# EAGLE design MACH DEM sp dung ic74192 (EAGLE 5.07)
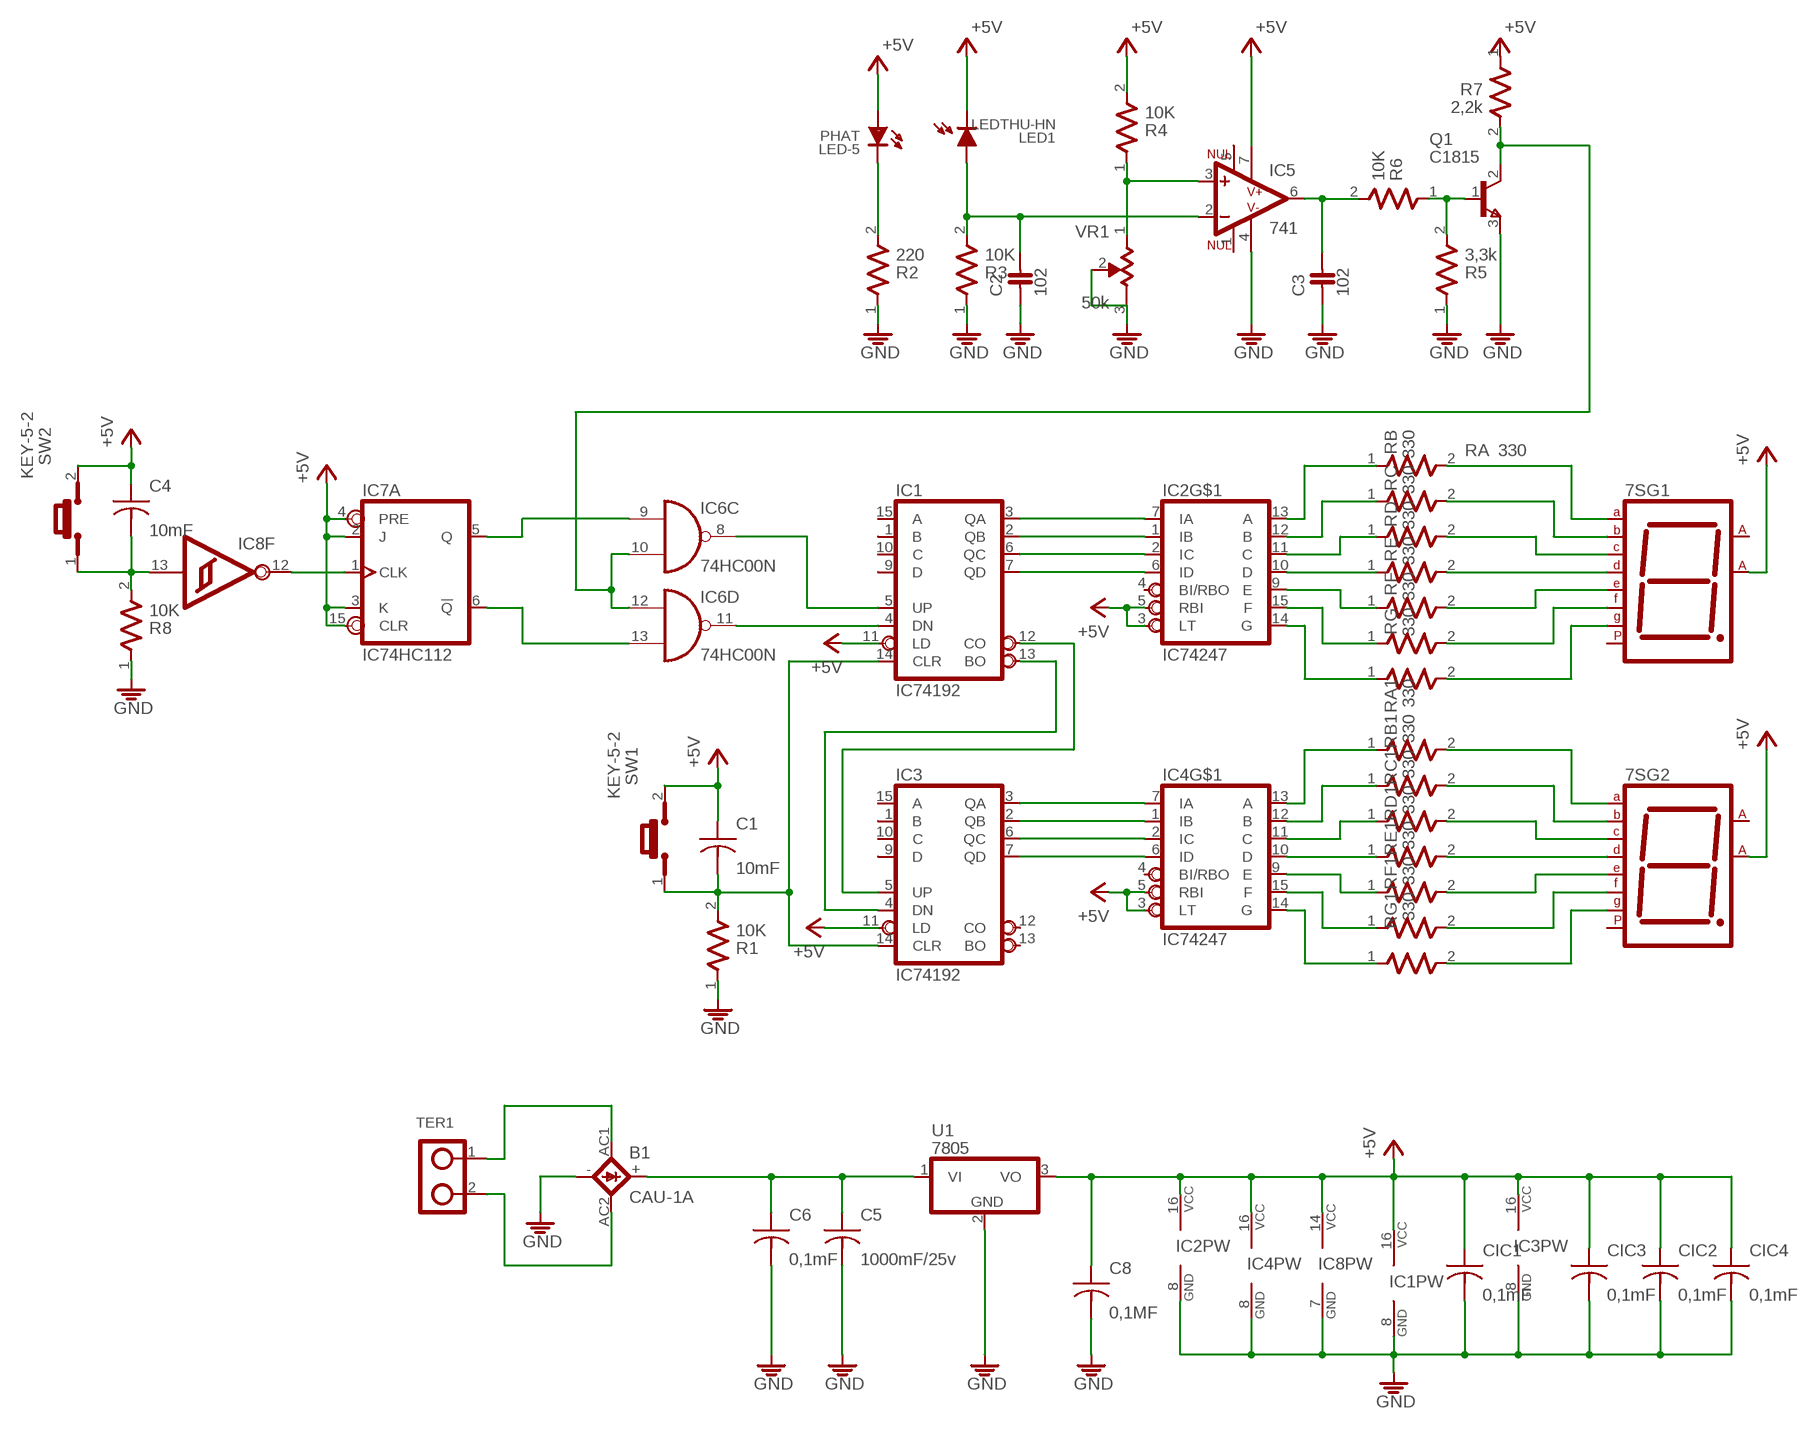
[diagram p0: schematic, sheet 1]

## Parts
7SG1  7SG-A1  [7SG-A]
7SG2  7SG-A1  [7SG-A]
B1  CAU-1A  [CAU-1A]
C1  10mF  CAP-2,5  [CAP-2,5]
C2  102  CAPNP-2,5  [CANP-2,5]
C3  102  CAPNP-2,5  [CANP-2,5]
C4  10mF  CAP-2,5  [CAP-2,5]
C5  1000mF/25v  CAP-5  [CAP-5]
C6  0,1mF  CAP-2,5  [CAP-2,5]
C8  0,1MF  CAP-2,5  [CAP-2,5]
CIC1  0,1mF  CAP-2,5  [CAP-2,5]
CIC2  0,1mF  CAP-2,5  [CAP-2,5]
CIC3  0,1mF  CAP-2,5  [CAP-2,5]
CIC4  0,1mF  CAP-2,5  [CAP-2,5]
IC1  IC74192  [DIL-16]
IC2  IC74247  [DIL-16]
IC3  IC74192  [DIL-16]
IC4  IC74247  [DIL-16]
IC5  741  TL081  [DIL-8]
IC6  74HC00N  [DIL14]
IC7  IC74HC112  [DIL-16]
IC8  74HC14  [DIL-14]
LED1  LEDTHU-HN  [LED5]
PHAT  LED-5  [LED5]
Q1  C1815  [TO92L]
R1  10K  R-7,5  [R-7,5]
R2  220  R-7,5  [R-7,5]
R3  10K  R-7,5  [R-7,5]
R4  10K  R-7,5  [R-7,5]
R5  3,3k  R-7,5  [R-7,5]
R6  10K  R-7,5  [R-7,5]
R7  2,2k  R-7,5  [R-7,5]
R8  10K  R-7,5  [R-7,5]
RA  330  R-10  [R-10]
RA1  330  R-10  [R-10]
RB  330  R-10  [R-10]
RB1  330  R-10  [R-10]
RC  330  R-10  [R-10]
RC1  330  R-10  [R-10]
RD  330  R-10  [R-10]
RD1  330  R-10  [R-10]
RE  330  R-10  [R-10]
RE1  330  R-10  [R-10]
RF  330  R-10  [R-10]
RF1  330  R-10  [R-10]
RG  330  R-10  [R-10]
RG1  330  R-10  [R-10]
SW1  KEY-5-2  [KEY-5-2]
SW2  KEY-5-2  [KEY-5-2]
TER1  DOMINO-2  [DOMI-2]
U1  7805  78XX-S  [78XX-S]
VR1  50k  VR-5  [VR-5]

## Nets
+5V: 7SG1.8(CA2) 7SG2.8(CA2) C1.+ C4.+ C8.+ CIC1.+ CIC2.+ CIC3.+ CIC4.+ IC1.11(LD) IC1.16(VCC) IC2.3(LT) IC2.5(RBI) IC2.16(PW:VCC) IC3.11(LD) IC3.16(VCC) IC4.3(LT) IC4.5(RBI) IC4.16(PW:VCC) IC5.7(V+) IC7.2(A:J) IC7.3(A:K) IC7.4(A:PRE) IC7.15(A:CLR) IC8.14(PW:VCC) LED1.K PHAT.A R4.2 R7.1 SW1.2 SW2.2 U1.3(VO)
GND: B1.- C2.1 C3.1 C5.- C6.- C8.- CIC1.- CIC2.- CIC3.- CIC4.- IC1.8(GND) IC2.8(PW:GND) IC3.8(GND) IC4.8(PW:GND) IC5.4(V-) IC8.7(PW:GND) Q1.3(E) R1.1 R2.1 R3.1 R5.1 R8.1 U1.2(GND) VR1.2 VR1.3
N$1: IC1.2(QB) IC2.1(IB)
N$2: IC1.6(QC) IC2.2(IC)
N$3: IC1.7(QD) IC2.6(ID)
N$4: IC1.3(QA) IC2.7(IA)
N$5: IC2.13(A) RA.1
N$6: IC2.12(B) RB.1
N$7: IC2.11(C) RC.1
N$8: IC2.10(D) RD.1
N$9: IC2.9(E) RE.1
N$10: IC2.15(F) RF.1
N$11: IC2.14(G) RG.1
N$12: 7SG1.7(A) RA.2
N$13: 7SG1.6(B) RB.2
N$14: 7SG1.4(C) RC.2
N$15: 7SG1.2(D) RD.2
N$16: 7SG1.1(E) RE.2
N$17: 7SG1.9(F) RF.2
N$18: 7SG1.10(G) RG.2
N$19: IC5.3(+IN) R4.1 VR1.1
N$20: IC3.6(QC) IC4.2(IC)
N$21: IC3.7(QD) IC4.6(ID)
N$22: IC3.3(QA) IC4.7(IA)
N$23: IC4.13(A) RA1.1
N$24: IC4.12(B) RB1.1
N$25: IC4.11(C) RC1.1
N$26: IC4.10(D) RD1.1
N$27: IC4.9(E) RE1.1
N$28: IC4.15(F) RF1.1
N$29: IC4.14(G) RG1.1
N$30: 7SG2.7(A) RA1.2
N$31: 7SG2.6(B) RB1.2
N$32: 7SG2.4(C) RC1.2
N$33: 7SG2.2(D) RD1.2
N$34: 7SG2.1(E) RE1.2
N$35: 7SG2.9(F) RF1.2
N$36: 7SG2.10(G) RG1.2
N$37: IC1.12(CO) IC3.5(UP)
N$38: C2.2 IC5.2(-IN) LED1.A R3.2
N$39: PHAT.K R2.2
N$41: C1.- IC1.14(CLR) IC3.14(CLR) R1.2 SW1.1
N$42: Q1.1(B) R5.2 R6.1
N$43: C3.2 IC5.6(OUT) R6.2
N$44: IC6.10(C:I1) IC6.12(D:I0) Q1.2(C) R7.2
N$45: IC1.4(DN) IC6.11(D:O)
N$46: IC1.5(UP) IC6.8(C:O)
N$47: IC1.13(BO) IC3.4(DN)
N$48: IC6.9(C:I0) IC7.5(A:Q)
N$49: IC6.13(D:I1) IC7.6(A:!Q)
N$50: IC3.2(QB) IC4.1(IB)
N$51: B1.+ C5.+ C6.+ U1.1(VI)
N$52: C4.- IC8.13(F:I) R8.2 SW2.1
N$53: IC7.1(A:CLK) IC8.12(F:O)
N$54: B1.AC1 TER1.1
N$55: B1.AC2 TER1.2
Unconnected: 7SG1.3(CA1) 7SG1.5(DP) 7SG2.3(CA1) 7SG2.5(DP) IC1.1(B) IC1.9(D) IC1.10(C) IC1.15(A) IC2.4(BI/RBO) IC3.1(B) IC3.9(D) IC3.10(C) IC3.12(CO) IC3.13(BO) IC3.15(A) IC4.4(BI/RBO) IC6.1(A:I0) IC6.2(A:I1) IC6.3(A:O) IC6.4(B:I0) IC6.5(B:I1) IC6.6(B:O) IC7.7(B:!Q) IC7.9(B:Q) IC7.10(B:PRE) IC7.11(B:J) IC7.12(B:K) IC7.13(B:CLK) IC7.14(B:CLR) IC8.1(A:I) IC8.2(A:O) IC8.3(B:I) IC8.4(B:O) IC8.5(C:I) IC8.6(C:O) IC8.8(D:O) IC8.9(D:I) IC8.10(E:O) IC8.11(E:I)

## Power pins joined to a net without a drawn wire
GND: IC6.7(P:GND) IC7.8(PW:GND)
NUL-1: IC5.5(NUL-1)
NUL-2: IC5.1(NUL-2)
VCC: IC6.14(P:VCC) IC7.16(PW:VCC)

## Library data of the parts
7SG1 7SG2 = chuong:7SG-A1
B1 = chuong:CAU-1A
C1 C4 C6 C8 CIC1-CIC4 = chuong:CAP-2,5
C2 C3 = chuong:CAPNP-2,5
C5 = chuong:CAP-5
IC1 IC3 = chuong:IC74192
IC2 IC4 = chuong:IC74247
IC5 = chuong:TL081
IC6 = 74xx-eu:74*00: Quad 2-input NAND gate
IC7 = chuong:IC74HC112
IC8 = chuong:74HC14
LED1 = chuong:LEDTHU-HN
PHAT = chuong:LED-5
Q1 = chuong:C1815
R1-R8 = chuong:R-7,5
RA RA1 RB RB1 RC RC1 RD RD1 RE RE1 RF RF1 RG RG1 = chuong:R-10
SW1 SW2 = chuong:KEY-5-2
TER1 = chuong:DOMINO-2
U1 = chuong:78XX-S
VR1 = chuong:VR-5

## Net classes
0 default: width 0.7 mm, clearance 0.7 mm

## Board
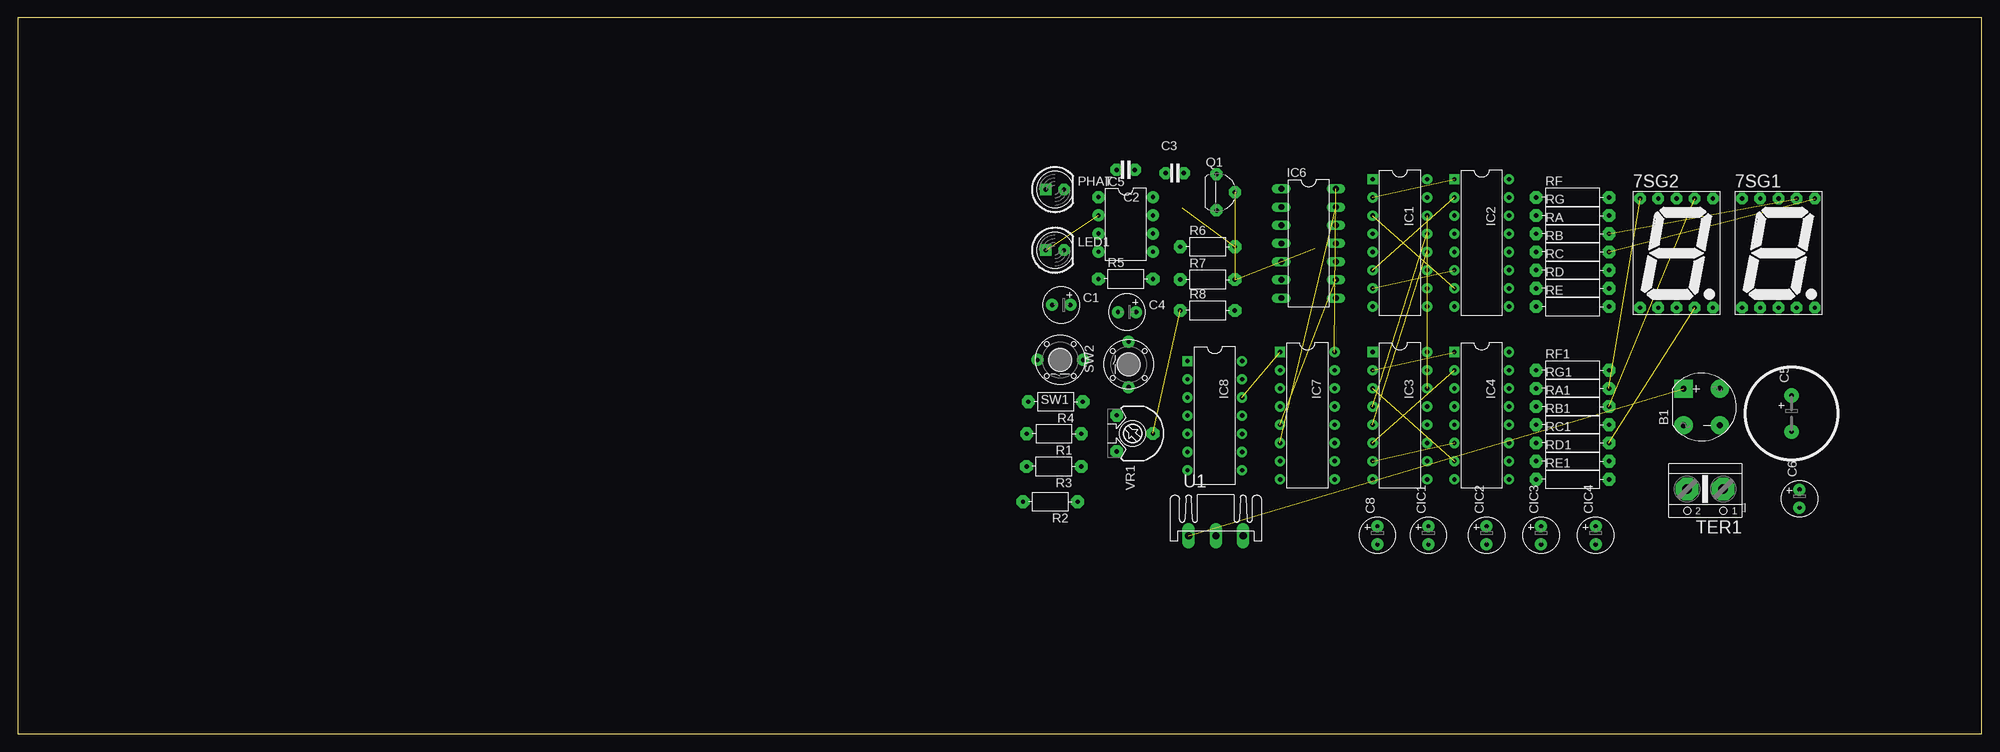
[diagram p1: board, top side]
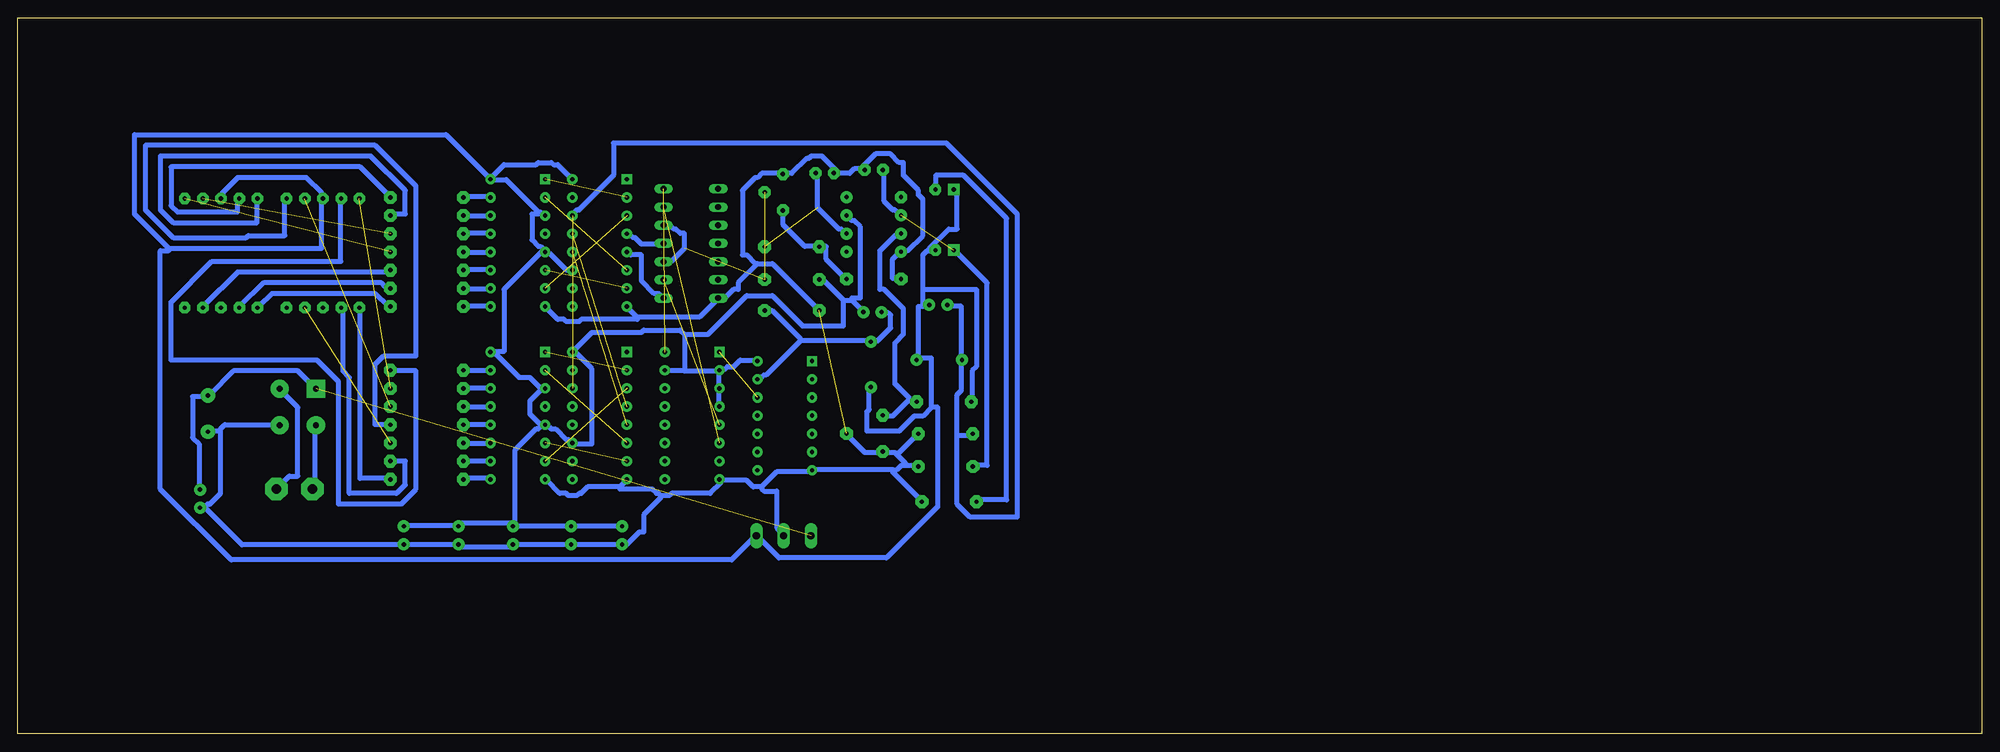
[diagram p2: board, bottom side, seen from below]

Size 274.3 x 100 mm. Coordinates in mm from the lower left corner, seen from the top.
Outline: 0,0 274.3,0 274.3,100 0,100 0,0
Copper layers (1*16): Top 0.035mm / dielectric 1.5mm / Bottom 0.035mm
Design rules "default": minimum track width 10mil, minimum drill 24mil, track to track 8mil, track to pad 8mil, pad to pad 8mil, via to via 8mil, smd to smd 8mil, copper to edge 40mil, drill to drill 8mil, minimum pad ring 10mil, minimum via ring 8mil, stop-mask expansion 4mil, vias tented up to drill 0mil, thermal gap 10mil

### Footprints (pad centres in the part's own frame; a part is rotated, then mirrored left to right if it is on the bottom)
7SG-A = drill 0.61 pad 1.6 octagon: 1 -5.08,-7.62; 2 -2.54,-7.62; 3 0,-7.62; 4 2.54,-7.62; 5 5.08,-7.62; 6 5.08,7.62; 7 2.54,7.62; 8 0,7.62; 9 -2.54,7.62; 10 -5.08,7.62
CAU-1A = drill 0.813 pad 2.54 square: + -2.54,2.54 | drill 0.813 pad 2.54 round: - 2.54,-2.54; AC1 2.54,2.54; AC2 -2.54,-2.54
CAP-2,5 = drill 0.61 pad 1.676 round: + 1.27,0; - -1.27,0
CANP-2,5 = drill 0.61 pad 1.676 octagon: 1 -1.27,0; 2 1.27,0
CAP-5 = drill 0.61 pad 2 round: + 2.54,0; - -2.54,0
DIL-16 = drill 0.61 pad 1.422 square: 1 -8.89,-3.81 | drill 0.61 pad 1.422 round: 2 -6.35,-3.81; 3 -3.81,-3.81; 4 -1.27,-3.81; 5 1.27,-3.81; 6 3.81,-3.81; 7 6.35,-3.81; 8 8.89,-3.81; 9 8.89,3.81; 10 6.35,3.81; 11 3.81,3.81; 12 1.27,3.81; 13 -1.27,3.81; 14 -3.81,3.81; 15 -6.35,3.81; 16 -8.89,3.81
DIL-8 = drill 0.61 pad 1.676 octagon: 1 -3.81,-3.81 | drill 0.61 pad 1.676 round: 2 -1.27,-3.81; 3 1.27,-3.81; 4 3.81,-3.81; 5 3.81,3.81; 6 1.27,3.81; 7 -1.27,3.81; 8 -3.81,3.81
DIL14 = drill 0.813 long: 1 -7.62,-3.81; 2 -5.08,-3.81; 3 -2.54,-3.81; 4 0,-3.81; 5 2.54,-3.81; 6 5.08,-3.81; 7 7.62,-3.81; 8 7.62,3.81; 9 5.08,3.81; 10 2.54,3.81; 11 0,3.81; 12 -2.54,3.81; 13 -5.08,3.81; 14 -7.62,3.81
DIL-14 = drill 0.61 pad 1.422 square: 1 -7.62,-3.81 | drill 0.61 pad 1.422 round: 2 -5.08,-3.81; 3 -2.54,-3.81; 4 0,-3.81; 5 2.54,-3.81; 6 5.08,-3.81; 7 7.62,-3.81; 8 7.62,3.81; 9 5.08,3.81; 10 2.54,3.81; 11 0,3.81; 12 -2.54,3.81; 13 -5.08,3.81; 14 -7.62,3.81
LED5 = drill 0.61 pad 1.6 square: A -1.27,0 | drill 0.61 pad 1.6 octagon: K 1.27,0
TO92L = drill 0.61 pad 1.676 octagon: 1 2.54,0; 2 0,2.54; 3 -2.54,0
R-7,5 = drill 0.61 pad 1.778 octagon: 1 -3.81,0; 2 3.81,0
R-10 = drill 0.61 pad 1.778 octagon: 1 -5.08,0; 2 5.08,0
KEY-5-2 = drill 0.61 pad 1.676 round: 1 -3.81,0; 2 2.54,0
DOMI-2 = drill 1.321 pad 3.15 octagon: 1 -2.515,0; 2 2.515,0
78XX-S = drill 1.016 pad 1.778 long: 1 -2.54,-1.27; 2 1.27,-1.27; 3 5.08,-1.27
VR-5 = drill 0.61 pad 1.778 octagon: 1 -2.54,-2.54; 2 0,2.54; 3 2.54,-2.54

### Placement (x,y rotation side)
7SG1  245.92,67.15 0 top
7SG2  231.68,67.15 0 top
B1  235.2,45.67 0 top
C1  145.73,59.92 0 top
C2  154.75,78.78 180 top
C3  161.6,78.34 0 top
C4  154.93,58.92 0 top
C5  247.75,44.74 90 top
C6  248.86,32.86 90 top
C8  189.91,27.74 90 top
CIC1  197.03,27.74 90 top
CIC2  205.15,27.74 90 top
CIC3  212.77,27.74 90 top
CIC4  220.39,27.74 90 top
IC1  193.04,68.58 270 top
IC2  204.47,68.58 270 top
IC3  193.04,44.45 270 top
IC4  204.47,44.45 270 top
IC5  154.75,71.16 270 top
IC6  180.3,68.5 270 top
IC7  180.11,44.45 270 top
IC8  167.18,44.45 270 top
LED1  144.86,67.56 0 top
PHAT  144.86,76.03 0 top
Q1  167.45,75.66 270 top
R1  144.72,41.93 180 top
R2  144.21,32.44 180 top
R3  144.71,37.36 180 top
R4  144.95,46.4 180 top
R5  154.75,63.54 0 top
R6  166.18,68.04 0 top
R7  166.18,63.46 0 top
R8  166.18,59.15 0 top
RA  217.17,69.85 0 top
RA1  217.17,45.72 0 top
RB  217.17,67.31 0 top
RB1  217.17,43.18 0 top
RC  217.17,64.77 0 top
RC1  217.17,40.64 0 top
RD  217.17,62.23 0 top
RD1  217.17,38.1 0 top
RE  217.17,59.69 0 top
RE1  217.17,35.56 0 top
RF  217.17,74.93 0 top
RF1  217.17,50.8 0 top
RG  217.17,72.39 0 top
RG1  217.17,48.26 0 top
SW1  146.23,52.24 0 top
SW2  155.16,50.97 270 top
TER1  235.7,34.2 180 top
U1  166.07,28.94 0 top
VR1  156.02,41.97 270 top

### Tracks (layer width: path | path; a pad name or v marks a point on that pad's centre or on a via)
+5V
  Bottom 0.7: 147,67.5 147.3,67.5 147.9,66.9 147.9,62.1 | 147,67.5 146.4,67.5 LED1.K | 147.9,60 147.9,62.1 | 147.9,60 147,60 C1.+ | PHAT.A 143.4,75.9 143.1,75.6 143.1,70.5 144.3,70.5 147,67.8 147,67.5 | IC1.16 197.1,77.7 198.9,79.5 199.5,79.5 199.8,79.8 201.6,79.8 201.9,79.5 206.4,79.5 208.2,77.7 IC2.16 | 201.6,72.9 201.3,72.9 201,72.6 200.7,72.6 IC2.3 | 201.6,72.9 206.1,77.4 208.2,77.4 IC2.16 | IC1.11 197.1,64.8 197.7,64.8 200.1,67.2 200.4,67.2 IC2.5 | 7SG1.8 245.7,75 245.7,75.6 243.6,77.7 234,77.7 231.9,75.6 231.9,75 7SG2.8 231.9,74.7 231.9,67.8 253.2,67.8 | 157.8,60.6 156.3,59.1 C4.+ | 159,60.6 157.8,60.6 | 159,60.6 162,63.6 162.3,63.6 R7.1 | IC7.4 176.4,45.9 176.4,48 IC7.3 176.4,48.3 176.4,50.4 IC7.2 | IC7.2 176.1,51 175.5,51 175.2,51.3 174.3,51.3 173.4,52.2 171,52.2 IC8.14 | 181.2,50.7 176.4,50.7 IC7.2 | 181.2,50.7 183.9,50.7 IC7.15 | 181.2,55.8 181.8,56.4 186.9,56.4 187.2,56.1 194.1,56.1 196.8,53.4 IC3.16 196.8,53.1 196.2,53.1 194.1,51 194.1,40.5 196.8,40.5 IC3.11 197.1,40.8 197.4,41.1 197.7,41.1 199.2,42.6 199.8,42.6 200.1,42.9 200.4,42.9 IC4.5 | 181.2,55.8 181.2,50.7 | IC4.5 201,43.2 201.3,43.2 202.8,44.7 202.8,46.5 201.3,48 200.7,48 IC4.3 201.3,48.3 202.8,49.8 204.3,49.8 207.6,53.1 208.2,53.1 IC4.16 207.6,53.4 206.4,53.4 206.4,62.1 201,67.5 IC2.5 | CIC4.+ 220.2,29.1 213,29.1 CIC3.+ 213,29.4 204.9,29.4 CIC2.+ | C8.+ 190.2,29.1 196.8,29.1 CIC1.+ 197.1,29.1 204.9,29.1 CIC2.+ | IC4.5 201.3,42.9 201.6,42.6 201.9,42.6 204.9,39.6 204.9,29.7 CIC2.+ | 147.9,60 147.9,59.7 148.5,59.7 148.5,52.5 SW1.2 148.2,52.5 146.7,52.5 146.7,45.6 | 146.7,45.6 147.9,44.4 149.1,44.4 151.2,42.3 155.7,42.3 155.7,45 155.4,45.3 155.4,48.3 SW2.2
  Bottom 0.7: 146.7,45.6 145.8,45.6 145.8,31.8 153,24.6 168,24.6 171,27.6 U1.3 171.3,27.6 174.6,24.3 244.5,24.3 254.4,34.2 254.4,67.5 253.2,67.5 253.2,67.8 | R4.2 141,46.5 141,50.7 140.4,51.3 140.4,62.1 147.9,62.1 | IC5.7 158.4,72.3 157.8,71.7 157.5,71.7 156.6,70.8 156.6,60.9 157.8,60.9 157.8,60.6 | IC2.5 200.7,67.5 201.3,68.1 201.6,68.1 202.5,69 202.5,72.6 201.6,72.6 201.6,72.9 | 159,60.6 159,57 164.7,57 168.9,61.2 172.5,61.2 177.9,55.8 181.2,55.8 | 253.2,67.8 258,72.6 258,83.7 214.5,83.7 208.5,77.7 IC2.16
GND  (1 unrouted)
  Bottom 0.7: 190.2,34.5 189.3,35.4 IC3.8 | 190.2,34.5 194.7,34.5 195.6,33.6 195.9,33.6 196.2,33.3 197.4,33.3 197.7,33.6 198.6,33.6 200.4,35.4 IC4.8 | 152.1,36.9 151.5,36.9 150.9,37.5 150.3,37.5 | 152.1,36.9 163.2,36.9 IC8.7 163.5,36.6 168.3,36.6 170.4,34.5 | 150.3,37.5 148.8,37.5 R3.1 | 170.4,34.5 171.6,34.5 172.5,35.4 176.1,35.4 IC7.8 176.1,35.1 177.6,33.6 183,33.6 183.3,33.3 184.5,33.3 | U1.2 167.4,27.9 168.3,28.8 168.3,33.9 170.1,33.9 170.4,34.2 170.4,34.5 | R2.1 148.2,32.7 152.1,36.6 152.1,36.9 | 151.8,39.3 153.3,39.3 VR1.3 153.6,39.3 156,39.3 158.4,41.7 VR1.2 | 151.8,39.3 150.3,37.8 150.3,37.5 | R1.1 148.8,41.7 151.2,39.3 151.8,39.3 | 184.5,33.3 184.8,33.6 185.1,33.6 185.7,34.2 190.2,34.2 190.2,34.5 | 246,42.3 246,33.6 247.5,32.1 247.8,32.1 248.1,31.8 248.7,31.8 C6.- 248.1,31.5 243,26.4 220.5,26.4 CIC4.- 220.2,26.4 213,26.4 CIC3.- 213,26.1 204.9,26.1 CIC2.- 204.9,26.4 197.1,26.4 CIC1.- 196.8,26.4 190.2,26.4 C8.- 189.6,26.4 189.3,26.4 187.5,28.2 186.9,28.2 186.9,30.6 184.5,33 184.5,33.3 | 246,42.3 247.5,42.3 C5.- | B1.- 237.9,43.2 245.4,43.2 246,42.6 246,42.3 | R5.1 151.2,63.6 152.1,63.6 152.1,66.3 151.2,67.2 IC5.4 150.9,67.5 150,67.5 147.9,69.6 147.9,74.7 148.5,75.3 148.5,75.9 150.6,78 150.6,79.8 151.2,79.8 152.4,81 154.5,81 156.3,79.2 C2.1 156.3,78.9 157.5,78.9 158.1,78.3 160.2,78.3 C3.1 159.9,78.6 162,80.7 163.5,80.7 163.8,80.4 164.1,80.4 166.2,78.3 167.4,78.3 Q1.3 167.7,78.3 170.4,78.3 171,77.7 171.3,77.7 173.1,75.9 173.1,66.9 172.5,66.9 171.3,65.7 171,65.7 | 187.8,58.2 179.1,58.2 176.7,60.6 IC6.7 176.4,60.9 175.5,60.9 174.3,62.1 173.7,62.1 173.7,63 171,65.7
  Bottom 0.7: 187.8,58.2 189,59.4 IC1.8 | IC2.8 200.4,59.4 198.9,57.9 198,57.9 197.7,57.6 195.9,57.6 195.6,57.9 187.8,57.9 187.8,58.2 | 171,65.7 168.9,65.7 162.6,59.4 R8.1
N$1  (1 unrouted)
N$2  (1 unrouted)
N$3  (1 unrouted)
N$4  (1 unrouted)
N$5
  Bottom 0.7: IC2.13 208.5,69.9 211.8,69.9 RA.1
N$6
  Bottom 0.7: IC2.12 208.5,67.2 211.8,67.2 RB.1
N$7
  Bottom 0.7: IC2.11 208.5,64.8 211.8,64.8 RC.1
N$8
  Bottom 0.7: IC2.10 208.5,62.1 211.8,62.1 RD.1
N$9
  Bottom 0.7: IC2.9 208.5,59.7 211.8,59.7 RE.1
N$10
  Bottom 0.7: IC2.15 208.5,75 211.8,75 RF.1
N$11
  Bottom 0.7: IC2.14 208.5,72.3 211.8,72.3 RG.1
N$12  (1 unrouted)
N$13  (1 unrouted)
N$14
  Bottom 0.7: 7SG1.4 248.4,59.7 243.6,64.5 222.3,64.5 RC.2
N$15
  Bottom 0.7: 7SG1.2 243.3,59.7 240,63 223.5,63 222.9,62.4 222.3,62.4 RD.2
N$16
  Bottom 0.7: 7SG1.1 240.6,59.7 238.8,61.5 224.4,61.5 222.6,59.7 222.3,59.7 RE.2
N$17
  Bottom 0.7: 7SG1.9 243.6,74.7 243.6,72.9 252,72.9 252.9,73.8 252.9,79.2 226.5,79.2 222.3,75 RF.2
N$18
  Bottom 0.7: 7SG1.10 240.9,74.7 240.9,71.4 252.6,71.4 254.4,73.2 254.4,80.7 225,80.7 220.2,75.9 220.2,72.6 222,72.6 RG.2
N$19
  Bottom 0.7: 149.7,46.5 150,46.5 152.1,44.4 153.3,44.4 VR1.1 | 149.7,46.5 148.8,46.5 R4.1 | IC5.3 151.2,69.6 151.8,69.6 153.9,67.5 153.9,62.1 153.3,62.1 150.6,59.4 150.6,55.8 151.8,54.6 151.8,48.9 149.7,46.8 149.7,46.5
N$20  (1 unrouted)
N$21  (1 unrouted)
N$22  (1 unrouted)
N$23
  Bottom 0.7: IC4.13 208.5,45.6 211.8,45.6 RA1.1
N$24
  Bottom 0.7: IC4.12 208.5,43.2 211.8,43.2 RB1.1
N$25
  Bottom 0.7: IC4.11 208.5,40.5 211.8,40.5 RC1.1
N$26
  Bottom 0.7: IC4.10 RD1.1
N$27
  Bottom 0.7: IC4.9 208.5,35.7 211.8,35.7 RE1.1
N$28
  Bottom 0.7: IC4.15 208.5,50.7 211.8,50.7 RF1.1
N$29
  Bottom 0.7: IC4.14 208.5,48.3 211.8,48.3 RG1.1
N$30  (1 unrouted)
N$31
  Bottom 0.7: 7SG2.6 237,74.7 237,69.6 242.1,69.6 242.4,69.3 252.6,69.3 256.5,73.2 256.5,82.2 224.4,82.2 218.7,76.5 218.7,52.8 223.2,52.8 224.4,51.6 224.4,43.2 222.3,43.2 RB1.2
N$32  (1 unrouted)
N$33
  Bottom 0.7: 7SG2.2 228.9,59.4 228.9,50.7 228,49.8 228,33.6 221.4,33.6 220.2,34.8 220.2,38.1 RD1.2
N$34
  Bottom 0.7: 7SG2.1 226.5,59.4 226.5,35.7 222.3,35.7 RE1.2
N$35
  Bottom 0.7: 7SG2.9 229.2,74.7 229.2,66 247.2,66 252.9,60.3 252.9,52.2 232.5,52.2 229.5,49.2 229.5,32.1 220.8,32.1 218.7,34.2 218.7,50.7 222,50.7 RF1.2
N$36  (1 unrouted)
N$37  (1 unrouted)
N$38  (1 unrouted)
  Bottom 0.7: LED1.A 143.4,67.5 138.9,63 138.9,37.5 140.7,37.5 R3.2 | IC5.2 151.2,72.6 151.8,73.2 152.1,73.2 153.3,74.4 153.3,78.6 C2.2
N$39
  Bottom 0.7: PHAT.K 146.1,76.2 146.1,78 142.2,78 136.2,72 136.2,32.7 140.4,32.7 R2.2
N$41  (1 unrouted)
  Bottom 0.7: C1.- 144.3,59.7 142.5,59.7 142.5,52.5 SW1.1 142.5,51.9 142.5,48 143.1,47.4 143.1,41.7 | 143.1,41.7 143.1,32.1 141.3,30.3 134.7,30.3 134.7,72.6 144.6,82.5 191.1,82.5 191.1,78 195.9,73.2 196.2,73.2 196.8,72.6 IC1.14 | 143.1,41.7 141,41.7 R1.2
N$42
  Bottom 0.7: R5.2 158.7,63.6 161.4,66.3 161.4,68.1 162.3,68.1 R6.1 162.6,68.1 164.4,68.1 167.4,71.1 167.4,72.9 Q1.1
N$43  (1 unrouted)
  Bottom 0.7: IC5.6 158.7,69.9 159.3,70.5 159.6,70.5 162.6,73.5 162.6,78.3 C3.2
N$44  (2 unrouted)
  Bottom 0.7: IC6.10 183.9,66 183,66 181.2,67.8 181.2,69.9 181.8,69.9 182.4,70.5 182.7,70.5 183,70.8 183.9,70.8 IC6.12
N$45
  Bottom 0.7: IC6.11 184.2,68.4 187.2,68.4 188.1,69.3 188.4,69.3 188.7,69.6 189,69.6 IC1.4
N$46
  Bottom 0.7: IC6.8 184.2,60.9 184.8,61.5 185.4,61.5 187.2,63.3 187.2,66.9 188.7,66.9 189,67.2 IC1.5
N$47  (1 unrouted)
N$48  (1 unrouted)
N$49  (1 unrouted)
N$50  (1 unrouted)
N$51  (1 unrouted)
  Bottom 0.7: C6.+ 249,34.2 249,40.5 249.9,41.4 249.9,47.1 247.8,47.1 C5.+ 247.5,47.4 244.2,50.7 235.2,50.7 232.8,48.3 B1.+
N$52
  Bottom 0.7: C4.- 153.6,58.8 152.7,58.8 152.4,58.5 152.4,56.7 154.2,54.9 155.1,54.9 SW2.1 155.4,54.9 165,54.9 | 165,54.9 169.8,50.1 170.1,50.1 170.4,49.8 170.7,49.8 IC8.13 | R8.2 169.8,59.1 168.9,59.1 165,55.2 165,54.9
N$53  (1 unrouted)
N$54
  Bottom 0.7: B1.AC1 237.6,48 235.2,45.6 235.2,36 236.4,36 TER1.1
N$55
  Bottom 0.7: B1.AC2 232.8,42.9 232.8,34.2 TER1.2
VCC  (1 unrouted)